# EAGLE design Funktionsgenerator Power Supply (EAGLE 9.0.0)
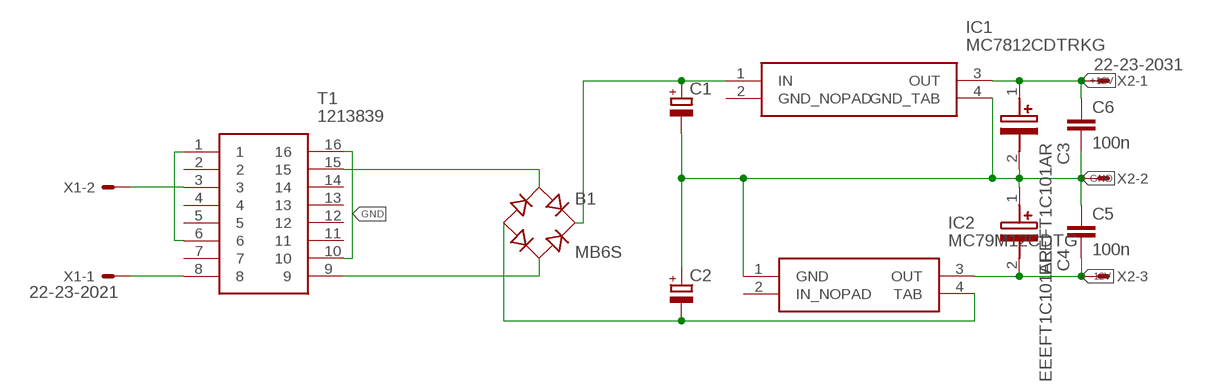
[diagram p0: schematic, sheet 1]

## Parts
B1  MB6S  [SOIC-4]
C1  CPOL-EUE5-13  [E5-13]
C2  CPOL-EUE5-13  [E5-13]
C3  EEEFT1C101AR  [HBV(C)]
C4  EEEFT1C101AR  [HBV(C)]
C5  100n  C-EUC0603  [C0603]
C6  100n  C-EUC0603  [C0603]
IC1  MC7812CDTRKG  [TO229P990X238-4N]
IC2  MC79M12CDTG  [TO229P990X238-4N]
T1  1213839  [DIPS3500W80P500L4400H2300Q16N]
X1  22-23-2021  [22-23-2021]
X2  22-23-2031  [22-23-2031]

## Nets
+12V: C3.1(+) C6.1 IC1.3(OUT) X2.1
-12V: C4.2(-) C5.2 IC2.3(OUT) X2.3
GND: C1.- C2.+ C3.2(-) C4.1(+) C5.1 C6.2 IC1.4(GND_TAB) IC2.1(GND) T1.10 T1.16 X2.2
N$1: T1.1 T1.6
N$2: T1.3 X1.2
N$3: T1.8 X1.1
N$5: B1.~1(AC1) T1.15
N$6: B1.~2(AC2) T1.9
N$7: B1.- C2.- IC2.4(TAB)
N$8: B1.+ C1.+ IC1.1(IN)
Unconnected: IC2.2(IN_NOPAD) T1.2 T1.4 T1.5 T1.7 T1.11 T1.12 T1.13 T1.14

## Power pins joined to a net without a drawn wire
GND_NOPAD: IC1.2(GND_NOPAD)

## Library data of the parts
B1 = rectifier:MB*S: Bridge Rectifier Source: http://www.fairchildsemi.com/ds/MB/MB6S.pdf
C1 C2 = resistor:CPOL-EU: POLARIZED CAPACITOR, European symbol
C3 C4 = SamacSys_Parts:EEEFT1C101AR: Panasonic Aluminium Electrolytic Capacitor 100F 16V dc 5mm Surface Mount C FT SMD Series +105C Source: Datasheet <https://industrial.panasonic.com/cdbs/www-data/pdf/RDE0000/ABA0000C1240.pdf>; ALLIED_NUMBER: 70349111; ALLIED_PRICE/STOCK: https://www.alliedelec.com/panasonic-eeeft1c101ar/70349111/; ARROW_PART_NUMBER: EEEFT1C101AR; ARROW_PRICE/STOCK: https://www.arrow.com/en/products/eee-ft1c101ar/panasonic; DESCRIPTION: Panasonic Aluminium Electrolytic Capacitor 100F 16V dc 5mm Surface Mount C FT SMD Series +105C; HEIGHT: mm; MANUFACTURER_NAME: Panasonic; MANUFACTURER_PART_NUMBER: EEEFT1C101AR; RS_PART_NUMBER: 7472499P; RS_PRICE/STOCK: http://uk.rs-online.com/web/p/products/7472499P
C5 C6 = resistor:C-EU: CAPACITOR, European symbol
IC1 = SamacSys_Parts:MC7812CDTRKG: Source: Datasheet <http://www.onsemi.com/pub/Collateral/MC7800-D.PDF>; ALLIED_NUMBER: 70340128; ALLIED_PRICE/STOCK: http://www.alliedelec.com/on-semiconductor-mc7812cdtrkg/70340128/; ARROW_PART_NUMBER: MC7812CDTRKG; ARROW_PRICE/STOCK: https://www.arrow.com/en/products/mc7812cdtrkg/on-semiconductor; HEIGHT: 2.38mm; MANUFACTURER_NAME: ON Semiconductor; MANUFACTURER_PART_NUMBER: MC7812CDTRKG; RS_PART_NUMBER: 6889250P; RS_PRICE/STOCK: http://uk.rs-online.com/web/p/products/6889250P
IC2 = SamacSys_Parts:MC79M12CDTG: Source: Datasheet <http://www.onsemi.com/pub/Collateral/MC79M00-D.PDF>; ALLIED_NUMBER: 70100585; ALLIED_PRICE/STOCK: http://www.alliedelec.com/on-semiconductor-mc79m12cdtg/70100585/; ARROW_PART_NUMBER: MC79M12CDTG; ARROW_PRICE/STOCK: https://www.arrow.com/en/products/mc79m12cdtg/on-semiconductor; HEIGHT: 2.38mm; MANUFACTURER_NAME: ON Semiconductor; MANUFACTURER_PART_NUMBER: MC79M12CDTG; RS_PART_NUMBER: 6889326P; RS_PRICE/STOCK: http://uk.rs-online.com/web/p/products/6889326P
T1 = SamacSys_Parts:1213839: 2 x 6V ac 2 Output PCB Mount PCB Transformer, 6VA Source: Datasheet <https://docs-emea.rs-online.com/webdocs/15c2/0900766b815c22e2.pdf>; ARROW_PART_NUMBER: 1213839; ARROW_PRICE/STOCK: http://uk.rs-online.com/web/p/products/1213839; DESCRIPTION: 2 x 6V ac 2 Output PCB Mount PCB Transformer, 6VA; HEIGHT: 23mm; MANUFACTURER_NAME: RS Components; MANUFACTURER_PART_NUMBER: 1213839; RS_PART_NUMBER: 1213839; RS_PRICE/STOCK: http://uk.rs-online.com/web/p/products/1213839
X1 = con-molex:22-23-2021: .100" (2.54mm) Center Header - 2 Pin; MF: MOLEX; MPN: 22-23-2021; OC_FARNELL: 1462926; OC_NEWARK: 25C3832
X2 = con-molex:22-23-2031: .100" (2.54mm) Center Header - 3 Pin; MF: MOLEX; MPN: 22-23-2031; OC_FARNELL: 1462950; OC_NEWARK: 30C0862

## Board
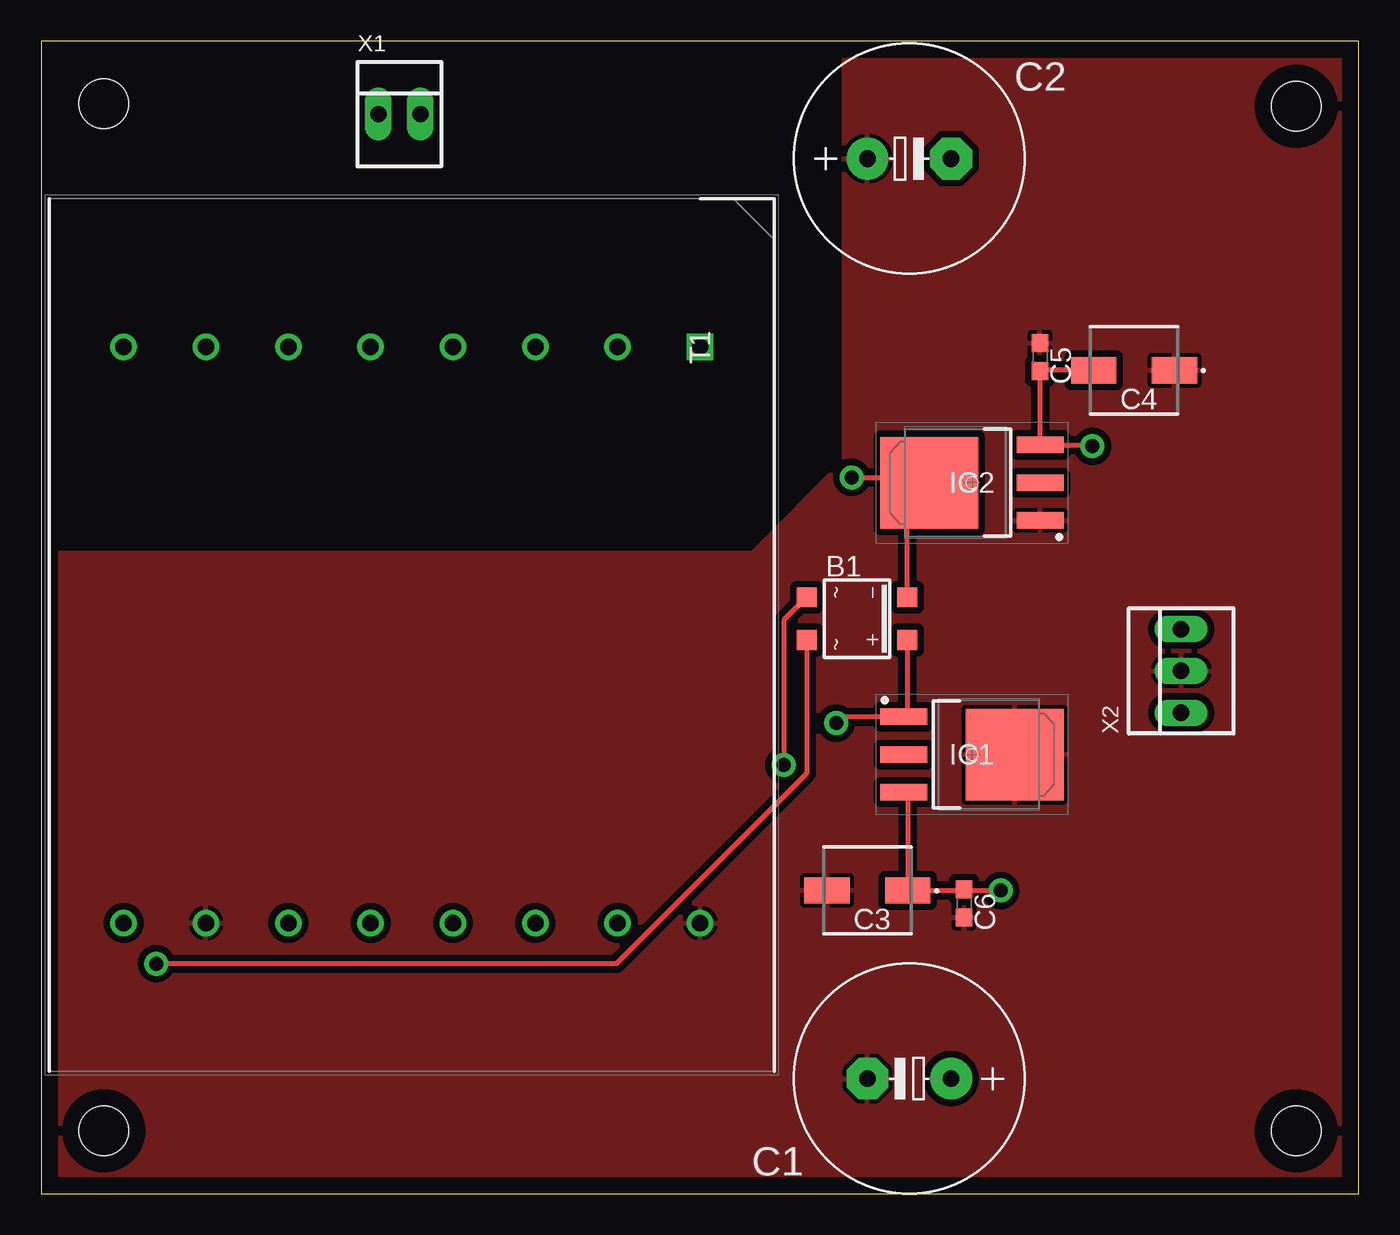
[diagram p1: board, top side]
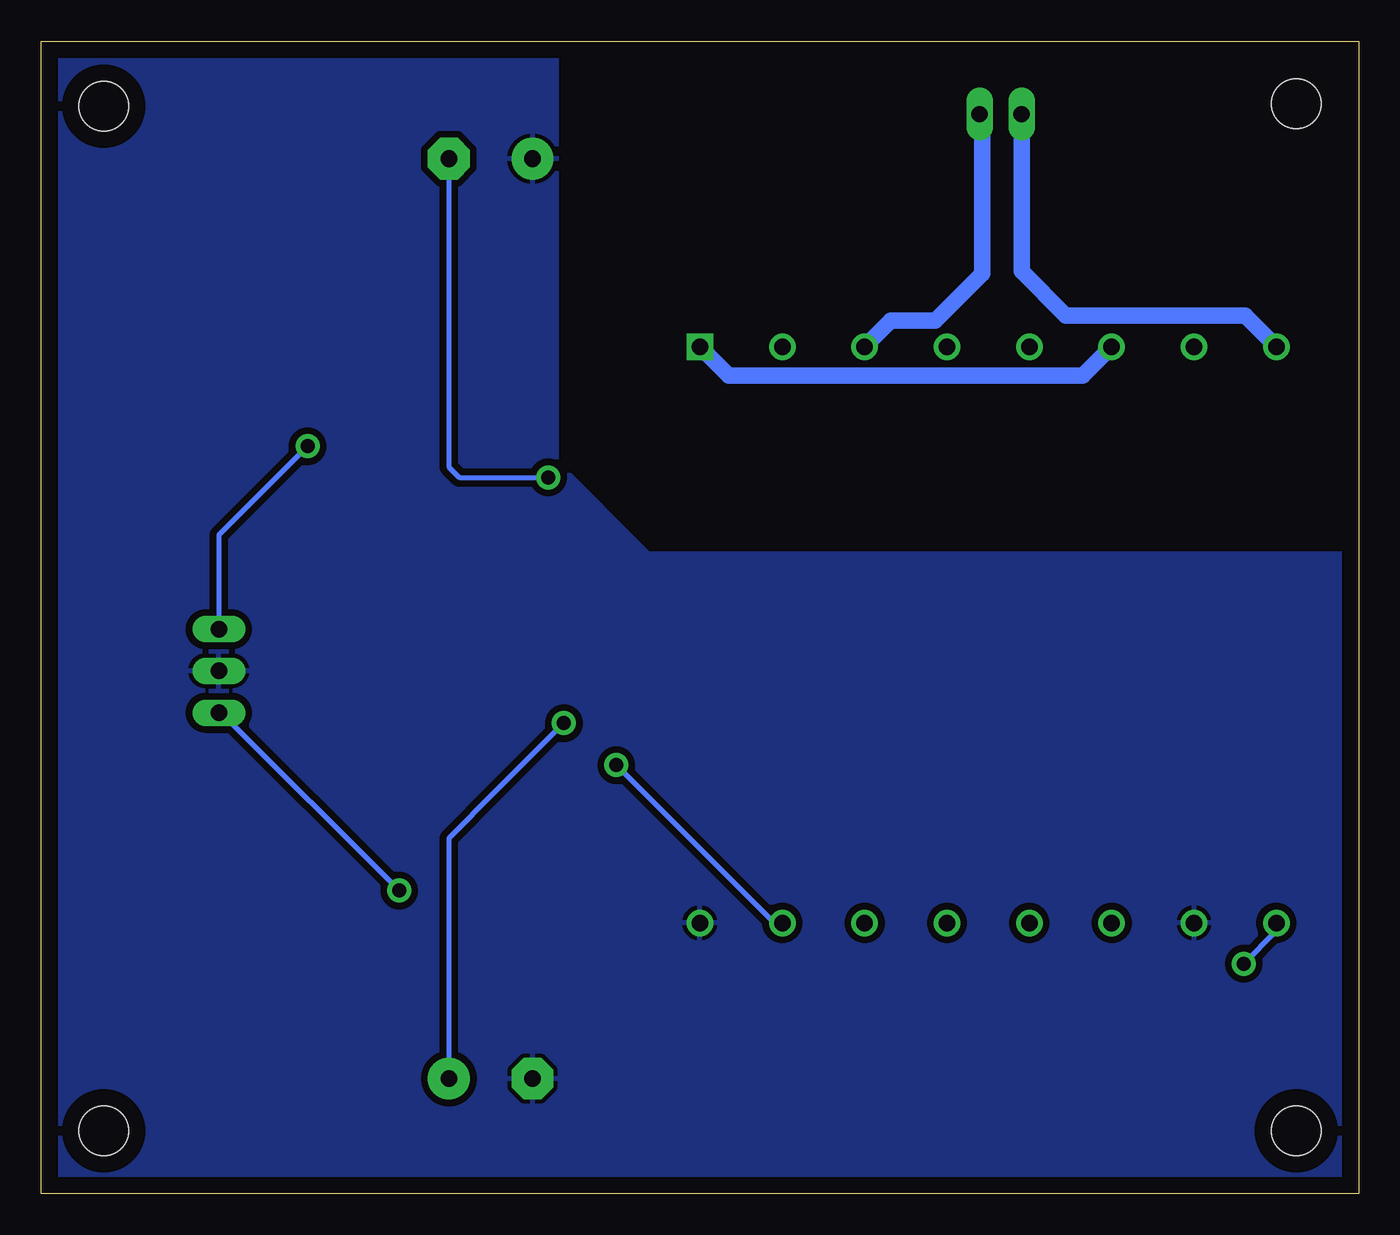
[diagram p2: board, bottom side, seen from below]

Size 80 x 70 mm. Coordinates in mm from the lower left corner, seen from the top.
Outline: 0,0 80,0 80,70 0,70 0,0
Copper layers (1+16): Top 0.035mm / dielectric 1.5mm / Bottom 0.035mm
Design rules "fraese_lpkf": minimum track width 12mil, minimum drill 24mil, track to track 8mil, track to pad 8mil, pad to pad 8mil, via to via 12mil, smd to smd 8mil, copper to edge 40mil, drill to drill 8mil, minimum pad ring 12mil, minimum via ring 12mil, stop-mask expansion 4mil, vias tented up to drill 0mil, thermal gap 10mil
Holes 3 mm at 3.81,3.81 3.81,66.2 76.2,3.81 76.2,66.04

### Footprints (pad centres in the part's own frame; a part is rotated, then mirrored left to right if it is on the bottom)
SOIC-4 = smd 1.2 x 1.2: + 1.3,3.05; - -1.3,3.05; ~1 -1.3,-3.05; ~2 1.3,-3.05
E5-13 = drill 1.016 pad 2.54: + -2.54,0 | drill 1.016 pad 2.54 octagon: - 2.54,0
HBV(C) = smd 2.75 x 1.6: 1 -2.45,0; 2 2.45,0
C0603 = smd 1.1 x 1: 1 -0.85,0; 2 0.85,0
TO229P990X238-4N = smd 2.85 x 1: 1 -4.15,2.29; 2 -4.15,0; 3 -4.15,-2.29 | smd 5.95 x 5.55: 4 2.6,0
DIPS3500W80P500L4400H2300Q16N = drill 1 pad 1.5 square: 1 0,0 | drill 1 pad 1.5: 2 0,-5; 3 0,-10; 4 0,-15; 5 0,-20; 6 0,-25; 7 0,-30; 8 0,-35; 9 35,-35; 10 35,-30; 11 35,-25; 12 35,-20; 13 35,-15; 14 35,-10; 15 35,-5; 16 35,0
22-23-2021 = drill 1 long: 1 -1.27,0; 2 1.27,0
22-23-2031 = drill 1 long: 1 -2.54,0; 2 0,0; 3 2.54,0

### Placement (x,y rotation side)
B1  49.53,34.92 270 top
C1  52.7,6.99 180 top
C2  52.7,62.87 0 top
C3  50.16,18.41 180 top
C4  66.36,50.01 180 top
C5  60.64,50.8 270 top
C6  56.04,17.62 270 top
IC1  56.52,26.67 0 top
IC2  56.52,43.18 180 top
T1  40.01,51.44 270 top
X1  21.75,65.56 0 top
X2  69.22,31.75 90 top

### Tracks (layer width: path | path; a pad name or v marks a point on that pad's centre or on a via)
+12V  (via drill 0.85)
  Top 0.305: IC1.3 52.62,24.13 C3.1 55.98,18.41 C6.1 56.09,18.41 v58.26,18.41
  Bottom 0.305: v58.26,18.41 69.06,29.21 X2.1
-12V  (via drill 0.85)
  Top 0.305: C4.2 60.7,50.01 60.66,49.97 | 60.66,49.97 C5.2 | v63.82,45.4 63.75,45.47 IC2.3 60.66,49.97
  Bottom 0.305: v63.82,45.4 69.22,40.01 X2.3
GND
  pour Top (isolate 0.406): 0,0 80.01,0 80.01,69.85 48.74,69.85 48.74,44.45 43.18,38.89 0,38.89
  pour Bottom (isolate 0.406): 0,38.89 0,0 80.01,0 80.01,69.85 48.74,69.85 48.74,44.45 43.18,38.89 42.55,38.89
N$1
  Bottom 1.016: T1.6 16.75,49.69 38.26,49.69 T1.1
N$2
  Bottom 1.016: T1.3 28.42,53.02 25.72,53.02 22.86,55.88 22.86,65.41 X1.2
N$3
  Bottom 1.016: X1.1 20.48,56.04 17.78,53.34 6.91,53.34 T1.8
N$4
  pour Top: 73.03,38.1 73.03,25.4 76.2,25.4 76.2,38.1
N$5  (via drill 0.85)
  Top 0.305: B1.~1 45.09,34.83 v45.09,26.04
  Bottom 0.305: v45.09,26.04 35.48,16.43 T1.15
N$6  (via drill 0.85)
  Top 0.305: B1.~2 46.48,25.52 34.92,13.97 v6.99,13.97
  Bottom 0.305: v6.99,13.97 5,15.95 T1.9
N$7  (via drill 0.85)
  Top 0.305: B1.- 52.58,41.84 IC2.4 54.18,43.45 54.13,43.5 v49.21,43.5
  Bottom 0.305: C2.- 55.24,44.13 54.61,43.5 v49.21,43.5
N$8  (via drill 0.85)
  Top 0.305: B1.+ 52.58,29.18 IC1.1 48.65,28.96 v48.26,28.57
  Bottom 0.305: v48.26,28.57 52.39,24.45 55.24,21.59 C1.+

### Text on the board
tRestrict: +12 GND -12